# EAGLE schematic pChannel (EAGLE 9.3.0)
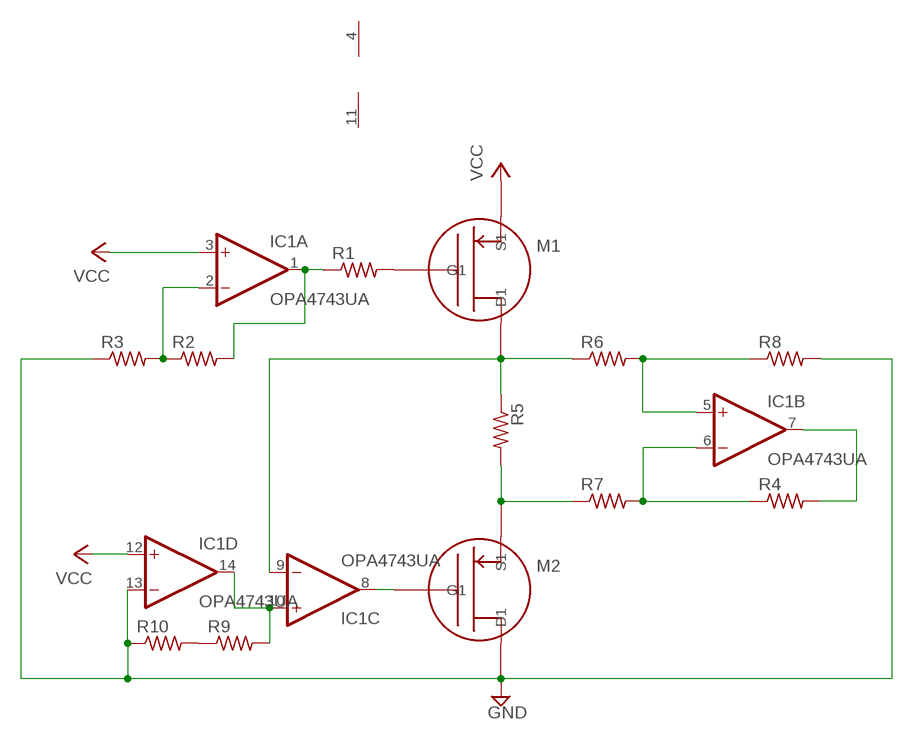
[diagram p0: schematic, sheet 1]

## Parts
IC1  OPA4743UA  [SO14]
M1  FET_P  (no package)
M2  FET_P  (no package)
R1  R-US_0204/5  [0204/5]
R2  R-US_0204/5  [0204/5]
R3  R-US_0204/5  [0204/5]
R4  R-US_0204/5  [0204/5]
R5  R-US_0204/5  [0204/5]
R6  R-US_0204/5  [0204/5]
R7  R-US_0204/5  [0204/5]
R8  R-US_0204/5  [0204/5]
R9  R-US_0204/5  [0204/5]
R10  R-US_0204/5  [0204/5]

## Nets
GND: IC1.13(D:-IN) M2.D1 R3.1 R8.2 R10.1
N$1: IC1.8(C:OUT) M2.G1
N$3: M2.S1 R5.2 R7.1
N$4: IC1.9(C:-IN) M1.D1 R5.1 R6.1
N$5: IC1.1(A:OUT) R1.1 R2.2
N$6: IC1.5(B:+IN) R6.2 R8.1
N$7: IC1.6(B:-IN) R4.1 R7.2
N$8: IC1.7(B:OUT) R4.2
N$9: M1.G1 R1.2
N$10: IC1.2(A:-IN) R2.1 R3.2
N$11: R9.1 R10.2
N$12: IC1.10(C:+IN) IC1.14(D:OUT) R9.2
VCC: IC1.3(A:+IN) IC1.12(D:+IN) M1.S1

## Power pins joined to a net without a drawn wire
V+: IC1.4(P:V+)
V-: IC1.11(P:V-)

## Library data of the parts
IC1 = linear:OPA4743: 12V, 7MHz, CMOS, Rail-to-Rail I/O Quad OP AMP Source: http://focus.ti.com/lit/ds/sbos201/sbos201.pdf
M1 M2 = ngspice-simulation:FET_P: P-Type MOS Field Effect Transistor (MOSFET)
R1-R4 R6-R10 = rcl:R-US_: RESISTOR, American symbol; SPICEPREFIX: R
R5 = rcl:R-US_: RESISTOR, American symbol; SPICEPREFIX: 52